# Altium schematic sheet 2_MCU.SchDoc
size 381 x 317 mm; SheetNumber: 2; SheetTotal: 3
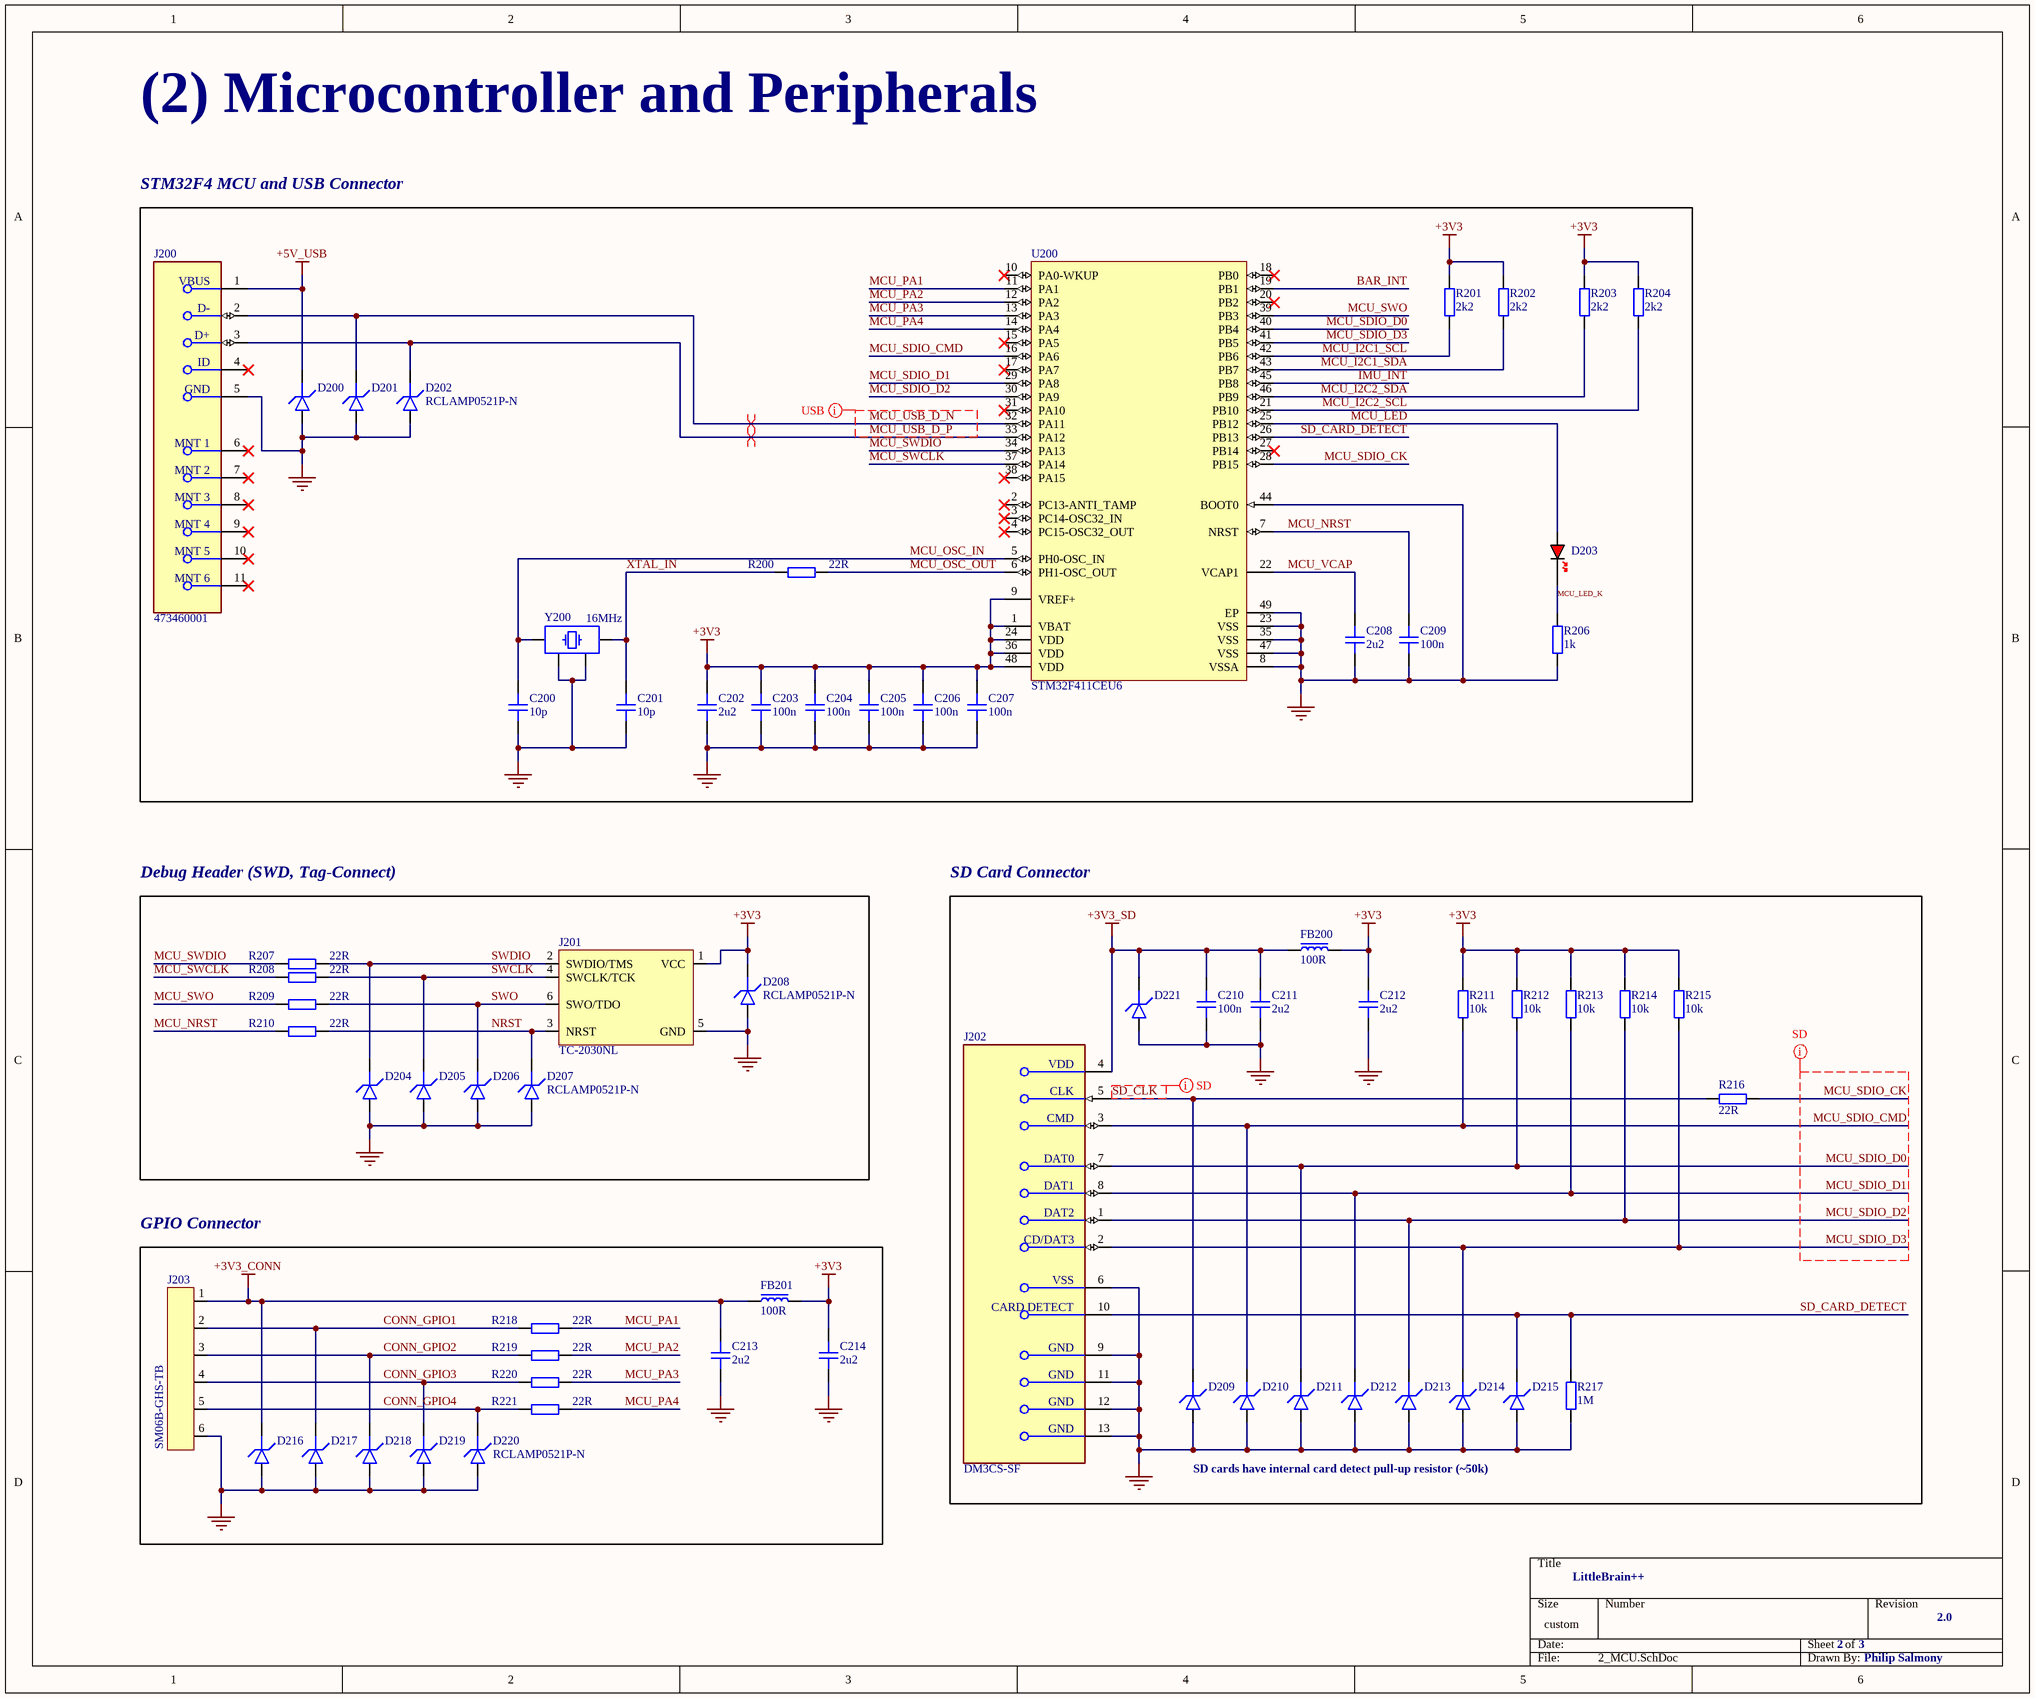
[diagram p0: 2_MCU.SchDoc]

## Parts
C200  10p  [CAP_0402]
C201  10p  [CAP_0402]
C202  2u2  [CAP_0603]
C203  100n  [CAP_0402]
C204  100n  [CAP_0402]
C205  100n  [CAP_0402]
C206  100n  [CAP_0402]
C207  100n  [CAP_0402]
C208  2u2  [CAP_0603]
C209  100n  [CAP_0402]
C210  100n  [CAP_0402]
C211  2u2  [CAP_0603]
C212  2u2  [CAP_0603]
C213  2u2  [CAP_0603]
C214  2u2  [CAP_0603]
D200  RCLAMP0521P-N  [D_0402]  (value not drawn)
D201  RCLAMP0521P-N  [D_0402]  (value not drawn)
D202  RCLAMP0521P-N  [D_0402]
D203  RED  [LED_0402_RED]  (value not drawn)
D204  RCLAMP0521P-N  [D_0402]  (value not drawn)
D205  RCLAMP0521P-N  [D_0402]  (value not drawn)
D206  RCLAMP0521P-N  [D_0402]  (value not drawn)
D207  RCLAMP0521P-N  [D_0402]
D208  RCLAMP0521P-N  [D_0402]
D209  RCLAMP0521P-N  [D_0402]  (value not drawn)
D210  RCLAMP0521P-N  [D_0402]  (value not drawn)
D211  RCLAMP0521P-N  [D_0402]  (value not drawn)
D212  RCLAMP0521P-N  [D_0402]  (value not drawn)
D213  RCLAMP0521P-N  [D_0402]  (value not drawn)
D214  RCLAMP0521P-N  [D_0402]  (value not drawn)
D215  RCLAMP0521P-N  [D_0402]  (value not drawn)
D216  RCLAMP0521P-N  [D_0402]  (value not drawn)
D217  RCLAMP0521P-N  [D_0402]  (value not drawn)
D218  RCLAMP0521P-N  [D_0402]  (value not drawn)
D219  RCLAMP0521P-N  [D_0402]  (value not drawn)
D220  RCLAMP0521P-N  [D_0402]
D221  RCLAMP0521P-N  [D_0402]  (value not drawn)
FB200  100R  [FB_0603]
FB201  100R  [FB_0603]
J200  473460001  [FP-473460001-MFG]
J201  TC-2030NL  [TC2030-NL-FP]
J202  DM3CS-SF  [FP-DM3CS-SF-MFG]
J203  SM06B-GHS-TB  [SM06B-GHS-TB]
R200  22R  [RES_0402]
R201  2k2  [RES_0402]
R202  2k2  [RES_0402]
R203  2k2  [RES_0402]
R204  2k2  [RES_0402]
R206  1k  [RES_0402]
R207  22R  [RES_0402]
R208  22R  [RES_0402]
R209  22R  [RES_0402]
R210  22R  [RES_0402]
R211  10k  [RES_0402]
R212  10k  [RES_0402]
R213  10k  [RES_0402]
R214  10k  [RES_0402]
R215  10k  [RES_0402]
R216  22R  [RES_0402]
R217  1M  [RES_0402]
R218  22R  [RES_0402]
R219  22R  [RES_0402]
R220  22R  [RES_0402]
R221  22R  [RES_0402]
U200  STM32F411CEU6  [STM-UFQFPN48_L]
Y200  16MHz  [XTAL_3225]

## Blocks framed on the sheet
STM32F4 MCU and USB Connector: C200-C209 D200-D203 J200 R200-R204 R206 U200 Y200
Debug Header (SWD, Tag-Connect): D204-D208 J201 R207-R210
SD Card Connector: C210-C212 D209-D215 D221 FB200 J202 R211-R217
GPIO Connector: C213 C214 D216-D220 FB201 J203 R218-R221

## Nets
+3V3: C202.2 C203.2 C204.2 C205.2 C206.2 C207.2 C212.2 C214.2 D208.K FB200.2 FB201.2 J201.1(VCC) R201.2 R202.2 R203.2 R204.2 R211.2 R212.2 R213.2 R214.2 R215.2 U200.1(VBAT) U200.9(VREF+) U200.24(VDD) U200.36(VDD) U200.48(VDD)
+3V3_CONN: C213.2 D216.K FB201.1 J203.1
+3V3_SD: C210.2 C211.2 D221.K FB200.1 J202.4(VDD)
+5V_USB: D200.K J200.1(VBUS)
GND: C200.1 C201.1 C202.1 C203.1 C204.1 C205.1 C206.1 C207.1 C208.1 C209.1 C210.1 C211.1 C212.1 C213.1 C214.1 D200.A D201.A D202.A D204.A D205.A D206.A D207.A D208.A D209.A D210.A D211.A D212.A D213.A D214.A D215.A D216.A D217.A D218.A D219.A D220.A D221.A J200.5(GND) J201.5(GND) J202.6(VSS) J202.9(GND) J202.11(GND) J202.12(GND) J202.13(GND) J203.6 R206.1 R217.1 U200.8(VSSA) U200.23(VSS) U200.35(VSS) U200.44(BOOT0) U200.47(VSS) U200.49(EP) Y200.2 Y200.4
BAR_INT: U200.19(PB1)
CONN_GPIO1: D217.K J203.2 R218.1
CONN_GPIO2: D218.K J203.3 R219.1
CONN_GPIO3: D219.K J203.4 R220.1
CONN_GPIO4: D220.K J203.5 R221.1
IMU_INT: U200.45(PB8)
MCU_I2C1_SCL: R201.1 U200.42(PB6)
MCU_I2C1_SDA: R202.1 U200.43(PB7)
MCU_I2C2_SCL: R204.1 U200.21(PB10)
MCU_I2C2_SDA: R203.1 U200.46(PB9)
MCU_LED: D203.A U200.25(PB12)
MCU_LED_K: D203.K R206.2
MCU_NRST: C209.2 R210.1 U200.7(NRST)
MCU_OSC_IN: C200.2 U200.5(PH0-OSC_IN) Y200.1
MCU_OSC_OUT: R200.2 U200.6(PH1-OSC_OUT)
MCU_PA1: R218.2 U200.11(PA1)
MCU_PA2: R219.2 U200.12(PA2)
MCU_PA3: R220.2 U200.13(PA3)
MCU_PA4: R221.2 U200.14(PA4)
MCU_SDIO_CK: R216.2 U200.28(PB15)
MCU_SDIO_CMD: D210.K J202.3(CMD) R211.1 U200.16(PA6)
MCU_SDIO_D0: D211.K J202.7(DAT0) R212.1 U200.40(PB4)
MCU_SDIO_D1: D212.K J202.8(DAT1) R213.1 U200.29(PA8)
MCU_SDIO_D2: D213.K J202.1(DAT2) R214.1 U200.30(PA9)
MCU_SDIO_D3: D214.K J202.2(CD/DAT3) R215.1 U200.41(PB5)
MCU_SWCLK: R208.1 U200.37(PA14)
MCU_SWDIO: R207.1 U200.34(PA13)
MCU_SWO: R209.1 U200.39(PB3)
MCU_USB_D_N: D201.K J200.2(D-) U200.32(PA11)
MCU_USB_D_P: D202.K J200.3(D+) U200.33(PA12)
MCU_VCAP: C208.2 U200.22(VCAP1)
NRST: D207.K J201.3(NRST) R210.2
SD_CARD_DETECT: D215.K J202.10(CARD_DETECT) R217.2 U200.26(PB13)
SD_CLK: D209.K J202.5(CLK) R216.1
SWCLK: D205.K J201.4(SWCLK/TCK) R208.2
SWDIO: D204.K J201.2(SWDIO/TMS) R207.2
SWO: D206.K J201.6(SWO/TDO) R209.2
XTAL_IN: C201.2 R200.1 Y200.3

Not connected (* = marked no-connect by the designer): J200 4(ID)* 6(MNT_1)* 7(MNT_2)* 8(MNT_3)* 9(MNT_4)* 10(MNT_5)* 11(MNT_6)*; U200 2(PC13-ANTI_TAMP)* 3(PC14-OSC32_IN)* 4(PC15-OSC32_OUT)* 10(PA0-WKUP)* 15(PA5)* 17(PA7)* 18(PB0)* 20(PB2)* 27(PB14)* 31(PA10)* 38(PA15)*

## Layout directives
differential pair; differential pair class DIFF_USB_FS: MCU_USB_D_N, MCU_USB_D_P
net class SD: MCU_SDIO_CK, MCU_SDIO_CMD, MCU_SDIO_D0, MCU_SDIO_D1, MCU_SDIO_D2, MCU_SDIO_D3, SD_CLK
net class USB: MCU_USB_D_N, MCU_USB_D_P

## Notes on the sheet
- (2) Microcontroller and Peripherals
- SD cards have internal card detect pull-up resistor (~50k)
- LittleBrain++
- 2
- 3
- 2.0
- Philip Salmony

## Library data of the parts
C200 C201 C203-C207 C209 C210 = CAP_0402_16V: Capacitor SMD 0402 16V
C202 C208 C211-C214 = CAP_0603_16V: Capacitor SMD 0603 16V
D200-D202 D204-D221 = D_TVS_0402: Diode TVS / ESD 0402
D203 = LED_0402_RED: LED 0402 RED SMD
FB200 FB201 = FB_0603: Ferrite Bead SMD 0603
J200 = CMP-2000-05246-2: CONN RCPT USB2.0 MICRO B SMD R/A; Manufacturer: Molex; Conn Orientation: Right Angle; Is Female: yes; Shielding: true; Pitch: 0.65mm; Number Of Contacts: 5; Voltage Rating: 30V; Current Rating: 1.8A; Device Class L2: USB Connectors; Digikey Description: CONN RCPT USB2.0 MICRO B SMD R/A; Height: 2.945mm; RoHS: TRUE; ComponentLink2Description: Datasheet; Octopart: https://octopart.com/47346-0001-molex-7164928; Automotive: No; Package: 0; Category: Conn; Device Class L1: Connectors; Usb Standard: USB 2.0; Temperature: -30°C to +85°C; Temperature Range Low: -30°C; Footprint Url: https://www.molex.com/pdm_docs/sd/473460001_sd.pdf; ComponentLink2URL: https://www.molex.com/webdocs/datasheets/pdf/en-us/0473460001_IO_CONNECTORS.pdf; Lead Free: Yes; Manufacturer Part Number: 473460001; Contact Material: Gold,Nickel; Temperature Range High: +85°C; Device Class L3: unset
J201 = TC2030-NL: Tag-Connect No-Solder SWD Debug Connector (No Legs) DO NOT PLACE; Manufacturer: Tag-Connect; Manfucaturer Number: TC2030-NL-FP
J202 = CMP-11597-000003-1: CONN MICRO SD CARD HINGED TYPE; Pitch: 1.1mm; Connector Type: Connector; Current Rating: 500mA; Voltage Rating (AC): 125V; Gender: Female; Insulation Resistance: 1GR; Number of Positions: 8; Contact Resistance: 100mR; Packaging: Tape and Reel; Flammability Rating: UL94 V-0; Lead Free: Lead Free; Min Operating Temperature: -25°C; Orientation: Right Angle; Width: 13.8mm; Number of Rows: 1; Housing Material: Polymer; Package Quantity: 1; Mount: Surface Mount; Max Current Rating: 500mA; Radiation Hardening: No; Max Operating Temperature: 85°C; Contact Plating: Gold; Depth: 1.83mm; Contact Material: Gold; Length: 14.1mm; Number of Contacts: 8; Termination: Solder
J203 = SM06B-GHS-TB: Header Connector 6 Position 1.25MM Pitch SMD Horizontal JST GH; Manufacturer: JST; Manufacturer Part Number: SM06B-GHS-TB
R200-R204 R206-R221 = RES_0402: Resistor SMD 0402
U200 = CMP-0243-00165-1: ARM Cortex-M4 32-bit MCU+FPU, 512 KB Flash, 128 KB RAM, 36 I/Os, 48-Pin UFQFPN, -40 to 85 degC, Tray; Operating Frequency(F) (Processor speed) (MHz): 100; FLASH Size (Prog) (kB): 512; Internal RAM Size (kB): 128; I/Os (High Current): 36; Supply Voltage(Vcc) min (V): 1.7; Package Reference: 48-Pin Ultra Thin Fine Pitch Quad Flat No-Lead, 7 x 7 x 0.6 mm Body, 0.5 mm Pitch, Exposed Pad; ComponentLink1Description: Manufacturer URL; ComponentLink1URL: http://www.st.com/; Packing: Tray; Package Description: UFQFPN48; Core: ARM Cortex-M4; ComponentLink2Description: Datasheet; ComponentLink2URL: http://www.st.com/st-web-ui/static/active/en/resource/technical/document/datasheet/DM00115249.pdf; DatasheetVersion: Rev. 6; Mounting Technology: Surface Mount
Y200 = TSX-3225_24.0000MF15X-AC: Crystal SMD 24MHz 10PPM 7pF 3225; Manufacturer: Epson; Manufacturer Number: TSX-3225 24.0000MF15X-AC; ESR: 40R; Value: 24MHz; Type: XTAL; Load Capacitance: 7pF